# EAGLE design ax5043_feather (EAGLE 8.2.2)
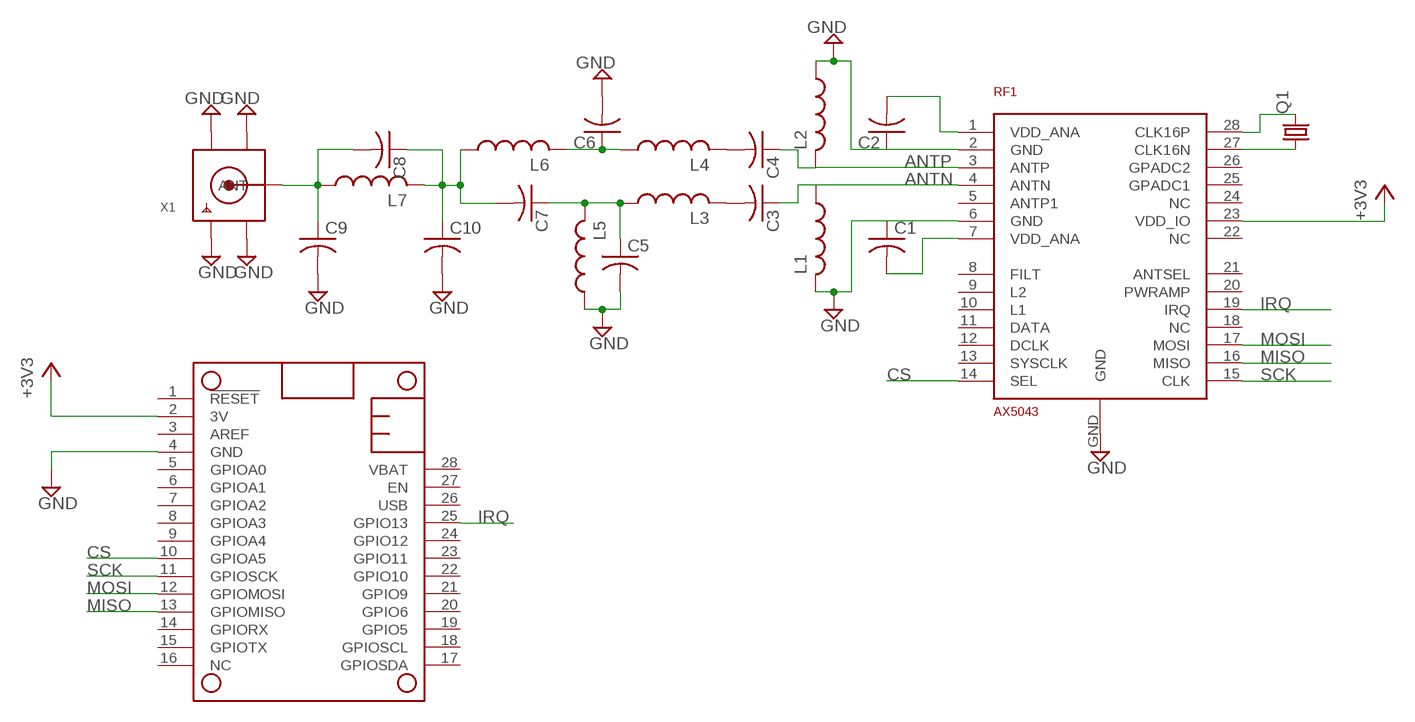
[diagram p0: schematic, sheet 1]

## Parts
C1  C-USC0603K  [C0603K]
C2  C-USC0603K  [C0603K]
C3  C-USC0603K  [C0603K]
C4  C-USC0603K  [C0603K]
C5  C-USC0603K  [C0603K]
C6  C-USC0603K  [C0603K]
C7  C-USC0603K  [C0603K]
C8  C-USC0603K  [C0603K]
C9  C-USC0603K  [C0603K]
C10  C-USC0603K  [C0603K]
L1  L-US0603K  [C0603K]
L2  L-US0603K  [C0603K]
L3  L-US0603K  [C0603K]
L4  L-US0603K  [C0603K]
L5  L-US0603K  [C0603K]
L6  L-US0603K  [C0603K]
L7  L-US0603K  [C0603K]
MS1  FEATHERWING  [FEATHERWING]
Q1  CRYSTALCTS406  [CTS406]
RF1  AX5043  [QFN28-5X5]
X1  SMACONNECTOR_EDGE_UFL  [SMA_EDGELAUNCH_UFL]

## Nets
+3V3: MS1.2(3V) RF1.23(VDD_IO)
ANTN: C3.1 L1.1 RF1.4(ANTN)
ANTP: C4.1 L2.2 RF1.3(ANTP)
CS: MS1.10(GPIOA5) RF1.14(SEL)
GND: C1.1 C2.1 C5.2 C6.2 C9.2 C10.2 L1.2 L2.1 L5.1 MS1.4(GND) RF1.2(GND) RF1.6(GND) RF1.GND X1.GND@1(GND1) X1.GND@2(GND2) X1.GND@3(GND3) X1.GND@4(GND4)
IRQ: MS1.25(GPIO13) RF1.19(IRQ)
MISO: MS1.13(GPIOMISO) RF1.16(MISO)
MOSI: MS1.12(GPIOMOSI) RF1.17(MOSI)
N$1: C2.2 RF1.1(VDD_ANA)
N$2: Q1.3 RF1.28(CLK16P)
N$3: Q1.1 RF1.27(CLK16N)
N$4: C1.2 RF1.7(VDD_ANA)
N$5: C4.2 L4.2
N$6: C3.2 L3.2
N$7: C5.1 C7.1 L3.1 L5.2
N$9: C6.1 L4.1 L6.2
N$10: C7.2 C8.1 C10.1 L6.1 L7.2
N$11: C8.2 C9.1 L7.1 X1.P(ANT)
SCK: MS1.11(GPIOSCK) RF1.15(CLK)
Unconnected: MS1.1(!RESET) MS1.3(AREF) MS1.5(GPIOA0) MS1.6(GPIOA1) MS1.7(GPIOA2) MS1.8(GPIOA3) MS1.9(GPIOA4) MS1.14(GPIORX) MS1.15(GPIOTX) MS1.16(NC) MS1.17(GPIOSDA) MS1.18(GPIOSCL) MS1.19(GPIO5) MS1.20(GPIO6) MS1.21(GPIO9) MS1.22(GPIO10) MS1.23(GPIO11) MS1.24(GPIO12) MS1.26(USB) MS1.27(EN) MS1.28(VBAT) RF1.5(ANTP1) RF1.8(FILT) RF1.9(L2) RF1.10(L1) RF1.11(DATA) RF1.12(DCLK) RF1.13(SYSCLK) RF1.18(NC) RF1.20(PWRAMP) RF1.21(ANTSEL) RF1.22(NC) RF1.24(NC) RF1.25(GPADC1) RF1.26(GPADC2)

## Library data of the parts
C1-C10 = rcl:C-US: CAPACITOR, American symbol
L1-L7 = kj4qlp:L-US0603K
MS1 = adafruit:FEATHERWING
Q1 = adafruit:CRYSTAL: CRYSTAL; OC_FARNELL: unknown; OC_NEWARK: unknown
RF1 = kj4qlp:AX5043
X1 = adafruit:SMACONNECTOR: SMA Connector 90° DIP SMA Connector, 50 Ohm (4UConnector: 07259)

## Board
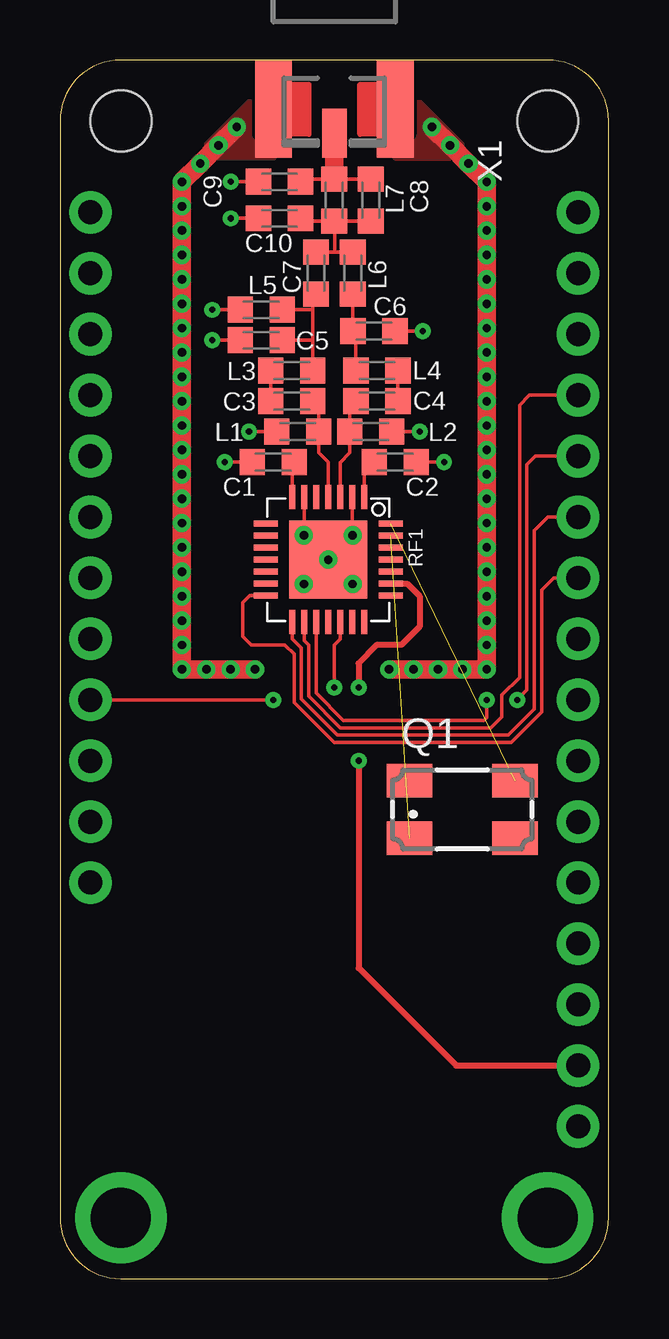
[diagram p1: board, top side]
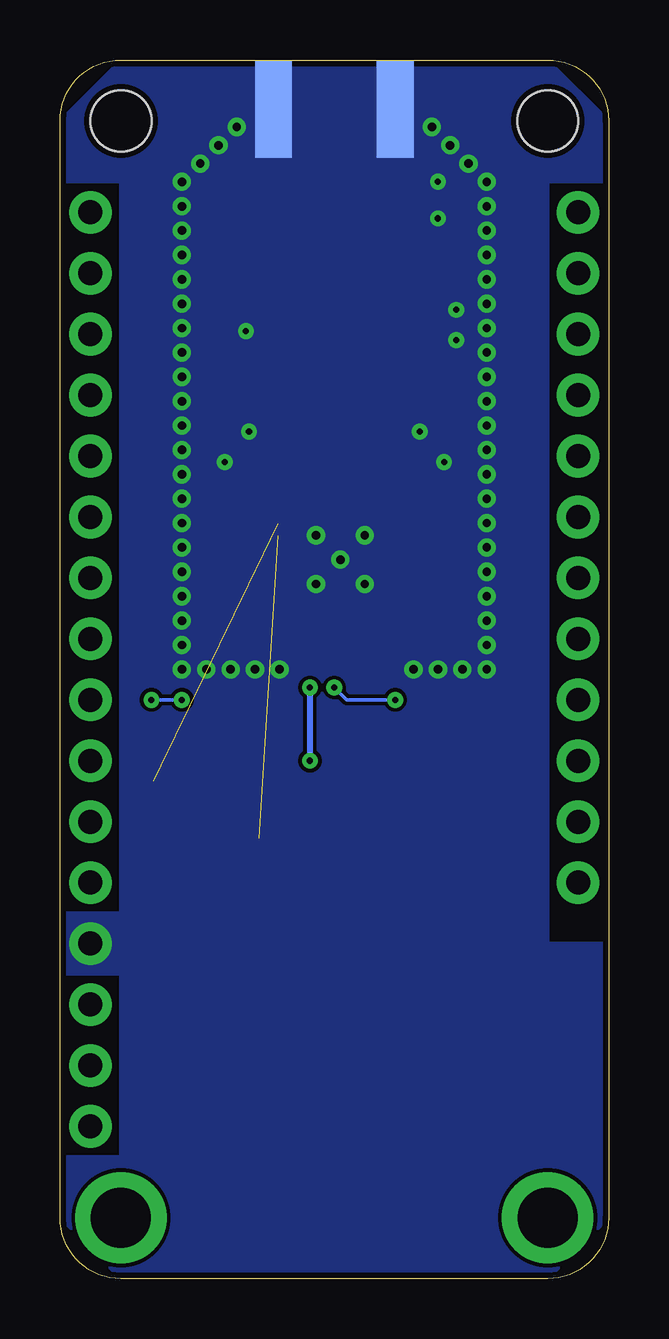
[diagram p2: board, bottom side, seen from below]

Size 22.86 x 50.8 mm. Coordinates in mm from the lower left corner, seen from the top.
Copper layers (1*16): Top 0.035mm / dielectric 1.5mm / Bottom 0.035mm
Design rules "default *": minimum track width 6mil, minimum drill 10mil, track to track 6mil, track to pad 6mil, pad to pad 6mil, via to via 6mil, smd to smd 6mil, copper to edge 10mil, drill to drill 6mil, minimum pad ring 10mil, minimum via ring 8mil, stop-mask expansion 4mil, vias tented up to drill 0mil, thermal gap 10mil

### Footprints (pad centres in the part's own frame; a part is rotated, then mirrored left to right if it is on the bottom)
C0603K = smd 1.05 x 1.08: 1 -0.875,0; 2 0.875,0
FEATHERWING = drill 1 pad 1.778: 1 6.35,1.27; 2 8.89,1.27; 3 11.43,1.27; 4 13.97,1.27; 5 16.51,1.27; 6 19.05,1.27; 7 21.59,1.27; 8 24.13,1.27; 9 26.67,1.27; 10 29.21,1.27; 11 31.75,1.27; 12 34.29,1.27; 13 36.83,1.27; 14 39.37,1.27; 15 41.91,1.27; 16 44.45,1.27; 17 44.45,21.59; 18 41.91,21.59; 19 39.37,21.59; 20 36.83,21.59; 21 34.29,21.59; 22 31.75,21.59; 23 29.21,21.59; 24 26.67,21.59; 25 24.13,21.59; 26 21.59,21.59; 27 19.05,21.59; 28 16.51,21.59 | drill 2.5 pad 3.81: P$1 2.54,20.32; P$2 2.54,2.54 | hole 2.54: 48.26,20.32; 48.26,2.54
CTS406 = smd 1.9 x 1.4: 1 -2.2,-1.2; 2 2.2,-1.2; 3 2.2,1.2; 4 -2.2,1.2
QFN28-5X5 = smd 0.25 x 1: 1 -1.5,-2.6; 2 -1,-2.6; 3 -0.5,-2.6; 4 0,-2.6; 5 0.5,-2.6; 6 1,-2.6; 7 1.5,-2.6; 15 1.5,2.6; 16 1,2.6; 17 0.5,2.6; 18 0,2.6; 19 -0.5,2.6; 20 -1,2.6; 21 -1.5,2.6 | smd 1 x 0.25: 8 2.6,-1.5; 9 2.6,-1; 10 2.6,-0.5; 11 2.6,0; 12 2.6,0.5; 13 2.6,1; 14 2.6,1.5; 22 -2.6,1.5; 23 -2.6,1; 24 -2.6,0.5; 25 -2.6,0; 26 -2.6,-0.5; 27 -2.6,-1; 28 -2.6,-1.5 | smd 3.25 x 3.25: GND 0,0
SMA_EDGELAUNCH_UFL = smd 4.064 x 1.524: GND@1 2.032,-2.54; GND@2 2.032,2.54 | smd 4.064 x 1.524 bottom: GND@3 2.032,2.54; GND@4 2.032,-2.54 | smd 2.032 x 1.016: P 3.048,0

### Placement (x,y rotation side)
C1  8.89,34.04 0 top
C2  13.97,34.04 180 top
C3  9.65,36.58 180 top
C4  13.21,36.58 0 top
C5  8.38,39.12 180 top
C6  13.08,39.5 0 top
C7  10.67,41.91 90 top
C8  12.95,44.96 90 top
C9  9.14,45.72 180 top
C10  9.14,44.2 180 top
L1  9.91,35.31 180 top
L2  12.95,35.31 180 top
L3  9.65,37.85 180 top
L4  13.21,37.85 0 top
L5  8.38,40.39 0 top
L6  12.19,41.91 270 top
L7  11.43,44.96 270 top
MS1  22.86,0 90 top
Q1  16.76,19.56 0 top
RF1  11.18,29.97 180 top
X1  11.43,50.8 270 top

### Tracks (layer width: path | path; a pad name or v marks a point on that pad's centre or on a via)
+3V3  (via drill 0.25)
  Top 0.254: RF1.23 14.46,28.97 14.99,28.45 14.99,27.18 14.22,26.42 13.21,26.42 12.45,25.65 v12.45,24.64 | MS1.2 16.51,8.89 12.45,12.95 v12.45,21.59
  Bottom 0.254: v12.45,24.64 v12.45,21.59
ANTN
  Top 0.152: C3.1 10.78,36.6 L1.1 10.78,34.43 11.18,34.04 RF1.4
ANTP
  Top 0.152: C4.1 12.08,36.6 L2.2 12.08,34.43 11.68,34.03 RF1.3
CS
  Top 0.152: MS1.10 20.57,29.21 20.07,28.7 20.07,23.62 18.8,22.35 11.43,22.35 9.75,24.03 9.75,26.03 9.37,26.42 7.97,26.42 7.62,26.77 7.62,28.19 7.9,28.47 RF1.14
GND  (via drill 0.25, 0.35)
  Top 0.152: 10.16,30.95 10.18,29.23 | 10.16,30.95 v10.16,30.99 | C9.2 v7.11,45.72 | C10.2 v7.11,44.2 | v6.35,40.39 L5.1 | v6.35,39.12 C5.2 | C6.2 v15.11,39.5 | C2.1 v16,34.04 | C1.1 v6.86,34.04 | L1.2 v7.87,35.31 | L2.1 v14.99,35.31 | RF1.6 10.18,30.96 10.16,30.95 | RF1.2 12.18,31 v12.19,30.99
  Top 0.762: v7.37,48.01 v6.6,47.24 v5.84,46.48 v5.08,45.72 v5.08,44.7 v5.08,43.69 v5.08,42.67 v5.08,41.66 v5.08,40.64 v5.08,39.62 v5.08,38.61 v5.08,37.59 v5.08,36.58 v5.08,35.56 v5.08,34.54 v5.08,33.53 v5.08,32.51 v5.08,31.5 v5.08,30.48 v5.08,29.46 v5.08,28.45 v5.08,27.43 v5.08,26.42 v5.08,25.4 v6.1,25.4 v7.11,25.4 v8.13,25.4 | v13.72,25.4 v14.73,25.4 v15.75,25.4 v16.76,25.4 v17.78,25.4 v17.78,26.42 v17.78,27.43 v17.78,28.45 v17.78,29.46 v17.78,30.48 v17.78,31.5 v17.78,32.51 v17.78,33.53 v17.78,34.54 v17.78,35.56 v17.78,36.58 v17.78,37.59 v17.78,38.61 v17.78,39.62 v17.78,40.64 v17.78,41.66 v17.78,42.67 v17.78,43.69 v17.78,44.7 v17.78,45.72 v17.02,46.48 v16.26,47.24 15.52,47.98
  other vias: 15.49,48.01 11.18,29.97 12.19,28.96 10.16,28.96
  pour Bottom (no thermals): 2.54,0 0,2.54 0,13.97 2.54,13.97 2.54,45.72 0,45.72 0,48.26 2.54,50.8 20.32,50.8 22.86,48.26 22.86,45.72 20.32,45.72 20.32,15.24 22.86,15.24 22.86,12.7 20.32,12.7 20.32,5.08 22.86,5.08 22.86,2.54 20.32,0
  pour Top (no thermals): 8.89,46.74 6.6,46.74 6.1,47.24 8.89,50.04
  pour Top (no thermals): 13.97,46.74 16.26,46.74 16.76,47.24 13.97,50.04
IRQ  (via drill 0.25)
  Top 0.152: RF1.19 11.68,26.67 11.42,26.41 v11.43,24.64 | MS1.25 v8.89,24.13
  Bottom 0.152: v8.89,24.13 10.92,24.13 v11.43,24.64
MISO
  Top 0.152: MS1.13 19.56,36.83 19.15,36.42 19.15,25.07 18.41,24.33 18.41,23.42 17.96,22.96 11.68,22.96 10.36,24.28 10.36,26.41 10.18,26.6 RF1.16
MOSI  (via drill 0.25)
  Top 0.152: MS1.12 19.81,34.29 19.46,33.93 19.46,24.89 | 19.46,24.79 19.46,24.89 | v17.78,24.13 17.78,23.39 17.65,23.27 11.81,23.27 10.67,24.41 10.67,26.29 10.68,26.53 RF1.17 | 19.46,24.89 19.46,24.54 v19.05,24.13
  Bottom 0.152: v17.78,24.13 v19.05,24.13
N$1
  Top 0.152: RF1.1 12.68,33.62 C2.2
N$2  (1 unrouted)
N$3  (1 unrouted)
N$4
  Top 0.152: RF1.7 9.68,33.95 C1.2
N$5
  Top 0.152: L4.2 C4.2
N$6
  Top 0.152: L3.2 C3.2
N$7
  Top 0.152: 10.53,39.14 L3.1 | 10.53,40.39 10.53,39.14 | 10.53,40.39 10.53,40.89 C7.1 | C5.1 10.5,39.12 10.53,39.14 | L5.2 10.27,40.39 10.53,40.39
N$9
  Top 0.152: L6.2 12.19,39.77 C6.1 12.33,39.37 L4.1
N$10
  Top 0.152: C8.1 11.44,44.08 | 11.44,42.78 L6.1 | 11.44,42.78 C7.2 | 11.44,44.08 L7.2 10.13,44.08 C10.1 | 11.44,44.08 11.44,42.78
N$11
  Top 0.152: C8.2 L7.1 10.13,45.83 C9.1
  Top 0.762: X1.P L7.1
SCK
  Top 0.152: MS1.11 20.32,31.75 19.76,31.19 19.76,23.75 18.67,22.66 11.56,22.66 10.06,24.16 10.06,26.29 9.68,26.67 RF1.15